# EAGLE design Christmas Tree (EAGLE 9.6.2)
CHECKED: 2021/12/20; COMPANY: https://github.com/milljohn/christmas_tree; DATE: 2018/11/05; DRAWN: 2018/11/05; DRGNO: 0; REV: 1
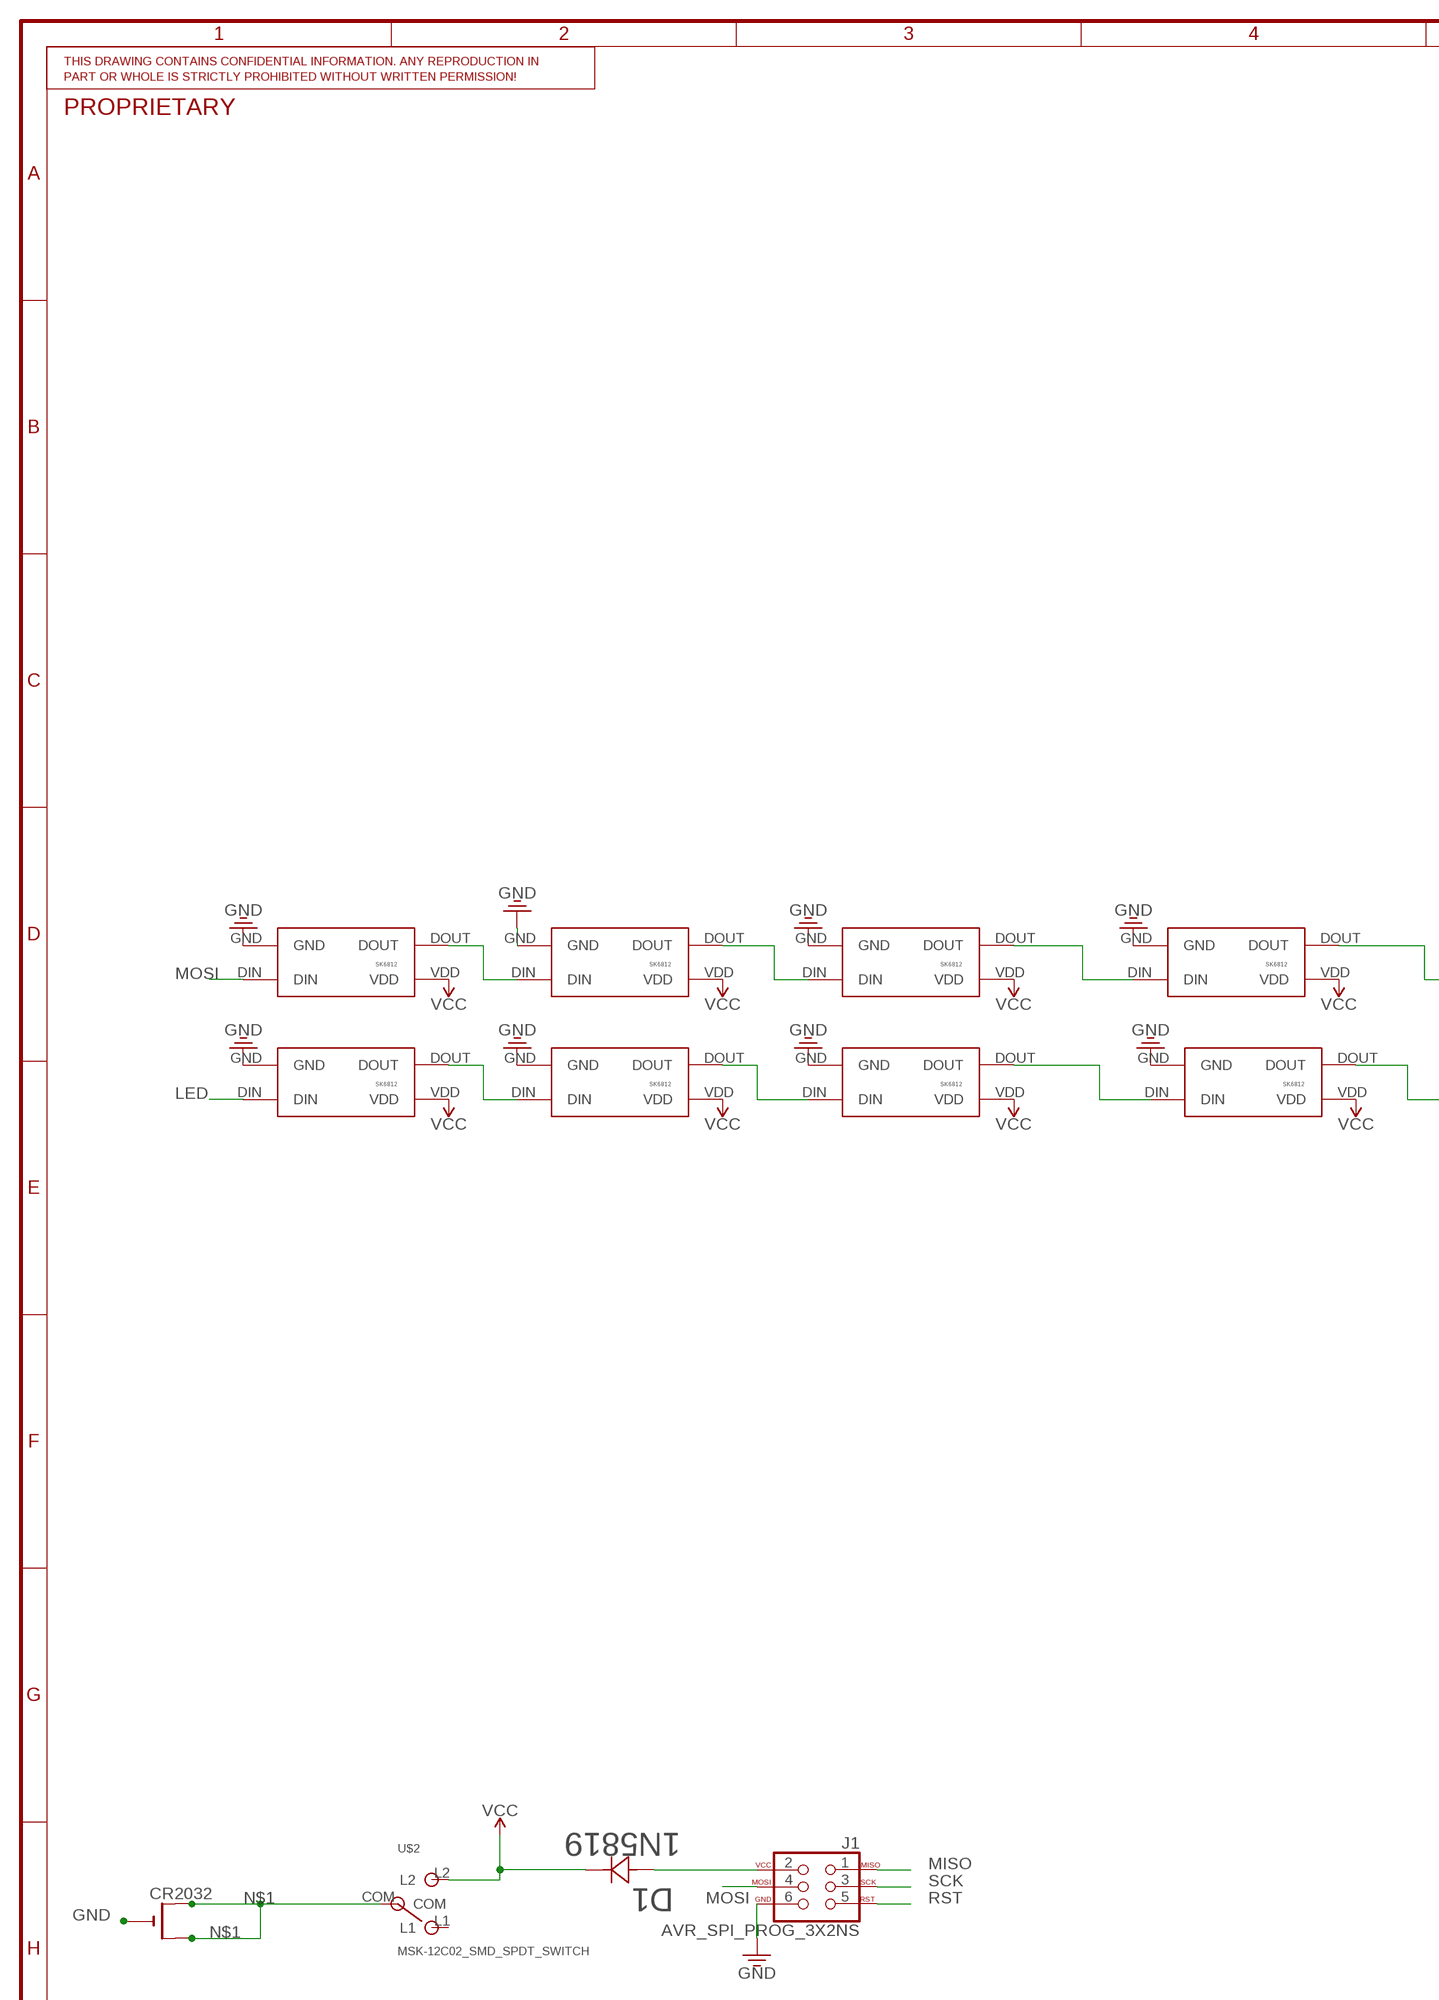
[diagram p0: schematic, sheet 1, part 1 of 2]
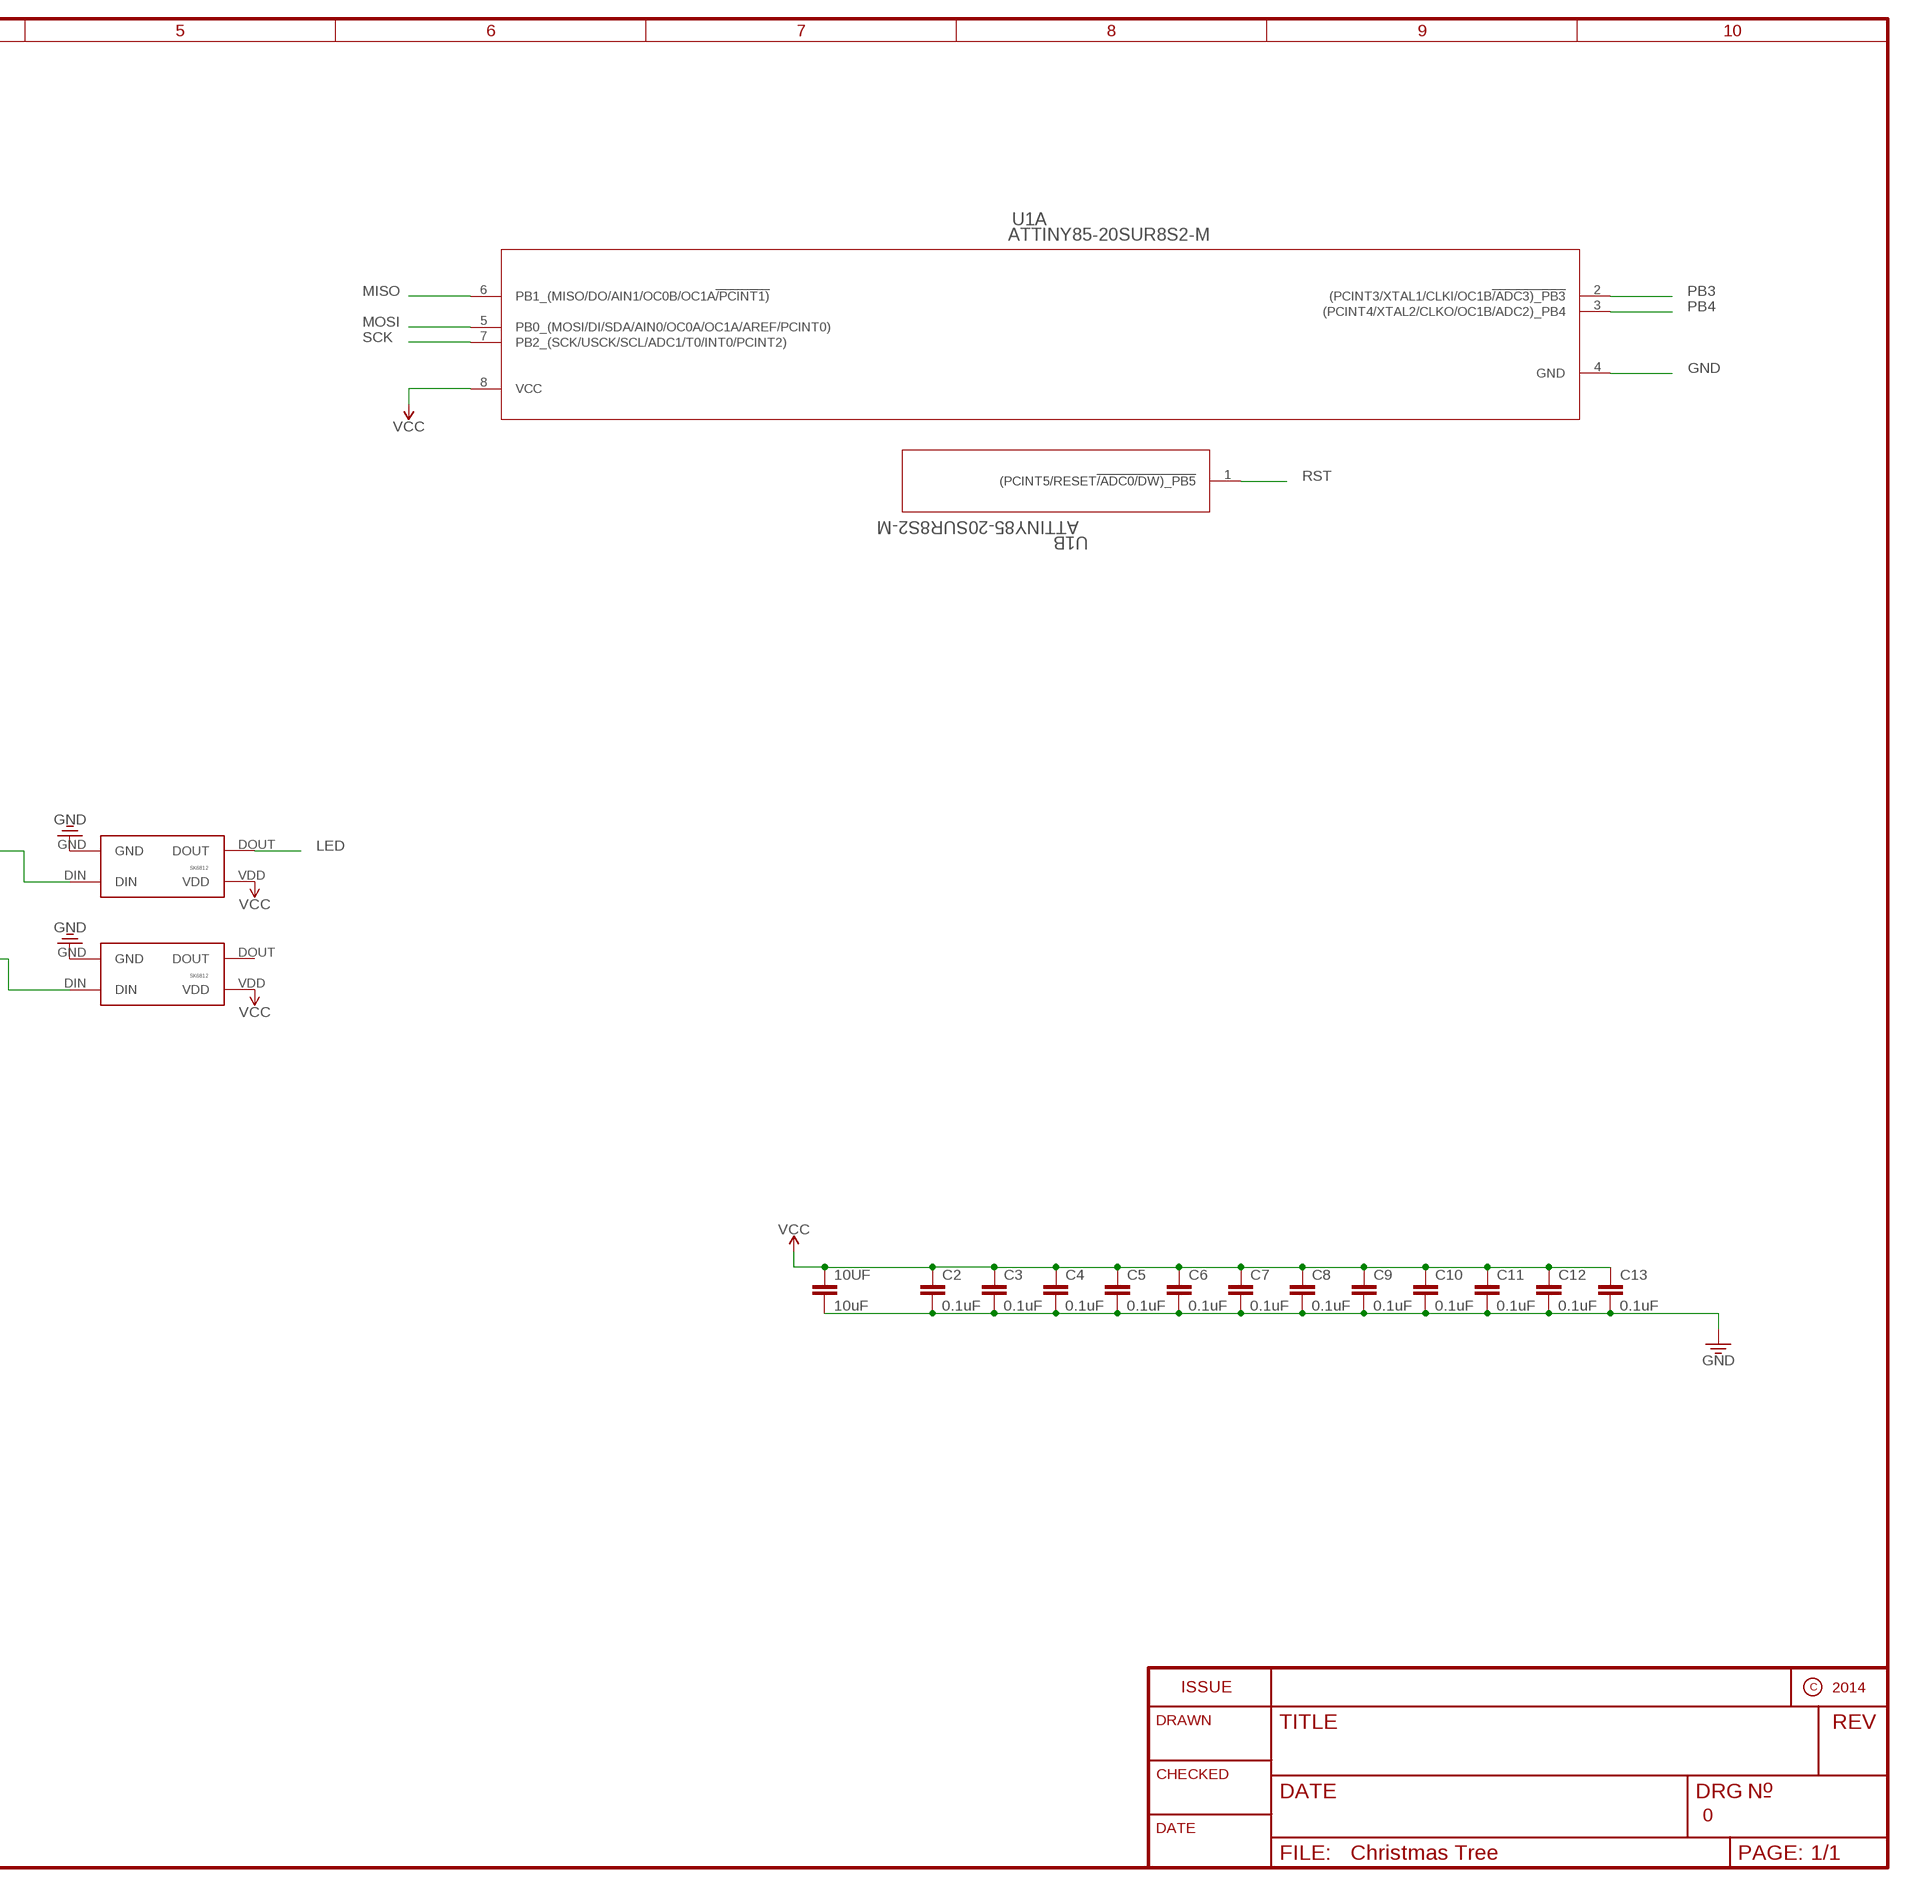
[diagram p1: schematic, sheet 1, part 2 of 2]

## Parts
10UF  10uF  CAPACITOR-N0805  [0805]
C2  0.1uF  CAPACITOR-N0805  [0805]
C3  0.1uF  CAPACITOR-N0805  [0805]
C4  0.1uF  CAPACITOR-N0805  [0805]
C5  0.1uF  CAPACITOR-N0805  [0805]
C6  0.1uF  CAPACITOR-N0805  [0805]
C7  0.1uF  CAPACITOR-N0805  [0805]
C8  0.1uF  CAPACITOR-N0805  [0805]
C9  0.1uF  CAPACITOR-N0805  [0805]
C10  0.1uF  CAPACITOR-N0805  [0805]
C11  0.1uF  CAPACITOR-N0805  [0805]
C12  0.1uF  CAPACITOR-N0805  [0805]
C13  0.1uF  CAPACITOR-N0805  [0805]
CR2032  CR2032SMT  [CR2032-SMD]
D1  1N5819  1N5819HW-7SOD123-M  [SOD123-M]
J1  AVR_SPI_PROG_3X2NS  [2X3-NS]
U1  ATTINY85-20SUR8S2-M  [8S2-M]
U$1  XMASTREE  [XMASTREE]  (not placed on a sheet)
U$2  MSK-12C02_SMD_SPDT_SWITCH  [MSK-12C02]
U$3  SK6812  [5050]
U$4  SK6812  [5050]
U$5  SK6812  [5050]
U$6  SK6812  [5050]
U$7  SK6812  [5050]
U$8  SK6812  [5050]
U$9  SK6812  [5050]
U$10  SK6812  [5050]
U$11  SK6812  [5050]
U$12  SK6812  [5050]

## Nets
GND: 10UF.2 C2.2 C3.2 C4.2 C5.2 C6.2 C7.2 C8.2 C9.2 C10.2 C11.2 C12.2 C13.2 CR2032.- J1.6 U1.4(A:GND) U$3.GND U$4.GND U$5.GND U$6.GND U$7.GND U$8.GND U$9.GND U$10.GND U$11.GND U$12.GND
LED: U$7.DOUT U$8.DIN
MISO: J1.1 U1.6(A:PB1_(MISO/DO/AIN1/OC0B/OC1A!/PCINT1))
MOSI: J1.4 U1.5(A:PB0_(MOSI/DI/SDA/AIN0/OC0A/OC1A/AREF/PCINT0)) U$3.DIN
N$1: CR2032.+$1(+) CR2032.+$2(+1) U$2.COM
N$2: U$4.DOUT U$5.DIN
N$3: U$5.DOUT U$6.DIN
N$4: U$6.DOUT U$7.DIN
N$5: U$9.DOUT U$10.DIN
N$6: U$8.DOUT U$9.DIN
N$7: U$10.DOUT U$11.DIN
N$8: U$11.DOUT U$12.DIN
N$9: U$3.DOUT U$4.DIN
N$10: D1.2 J1.2
PB3: U1.2(A:(PCINT3/XTAL1/CLKI/OC1B!/ADC3)_PB3)
PB4: U1.3(A:(PCINT4/XTAL2/CLKO/OC1B/ADC2)_PB4)
RST: J1.5 U1.1(B:(PCINT5/RESET!/ADC0/DW)_PB5)
SCK: J1.3 U1.7(A:PB2_(SCK/USCK/SCL/ADC1/T0/INT0/PCINT2))
VCC: 10UF.1 C2.1 C3.1 C4.1 C5.1 C6.1 C7.1 C8.1 C9.1 C10.1 C11.1 C12.1 C13.1 D1.1 U1.8(A:VCC) U$2.L2 U$3.VDD U$4.VDD U$5.VDD U$6.VDD U$7.VDD U$8.VDD U$9.VDD U$10.VDD U$11.VDD U$12.VDD
Unconnected: U$2.L1 U$12.DOUT

## Library data of the parts
10UF C2-C13 = BeagleBone_Blue_R3:CAPACITOR-N
CR2032 = adafruit:CR2032
D1 = smd_diodes:1N5819HW-7; MANUFACTURER_PART_NUMBER: 1N5819HW7; VENDOR: Diodes Inc
J1 = SparkFun-Connectors:AVR_SPI_PROG_3X2: AVR ISP 6 Pin This is the reduced ISP connector for AVR programming. Common on Arduino. This footprint will take up less PCB space and can be used with a 10-pin to 6-pin adapter such as SKU: BOB-08508 **Special note about "TEST_POINT" package. The stop mask is on the top side, so if you want your programming test points to be on the bottom of your board, make sure to place this package on the bottom side of the board. This also ensure that the orientation to program from the bottom side will be correct. SparkFun Products: SparkFun ISP Pogo Adapter <https://www.sparkfun.com/products/11591> - NS Tiny AVR Programmer <https://www.sparkfun.com/products/11801> -PTH
U1 = smd_leds:ATTINY85-20SUR; MANUFACTURER_PART_NUMBER: ATTINY8520SUR; VENDOR: Atmel
U$1 = smd_leds:XMASTREE
U$2 = MSK-12C02 SMD Micro Slider Switch SPDT:MSK-12C02_SMD_SPDT_SWITCH: Footprint of the VIMEX MSK-12C02 SPDT SMD Switch Created by mzst on 17-Jan-2016
U$3-U$12 = smd_leds:SK6812

## Board
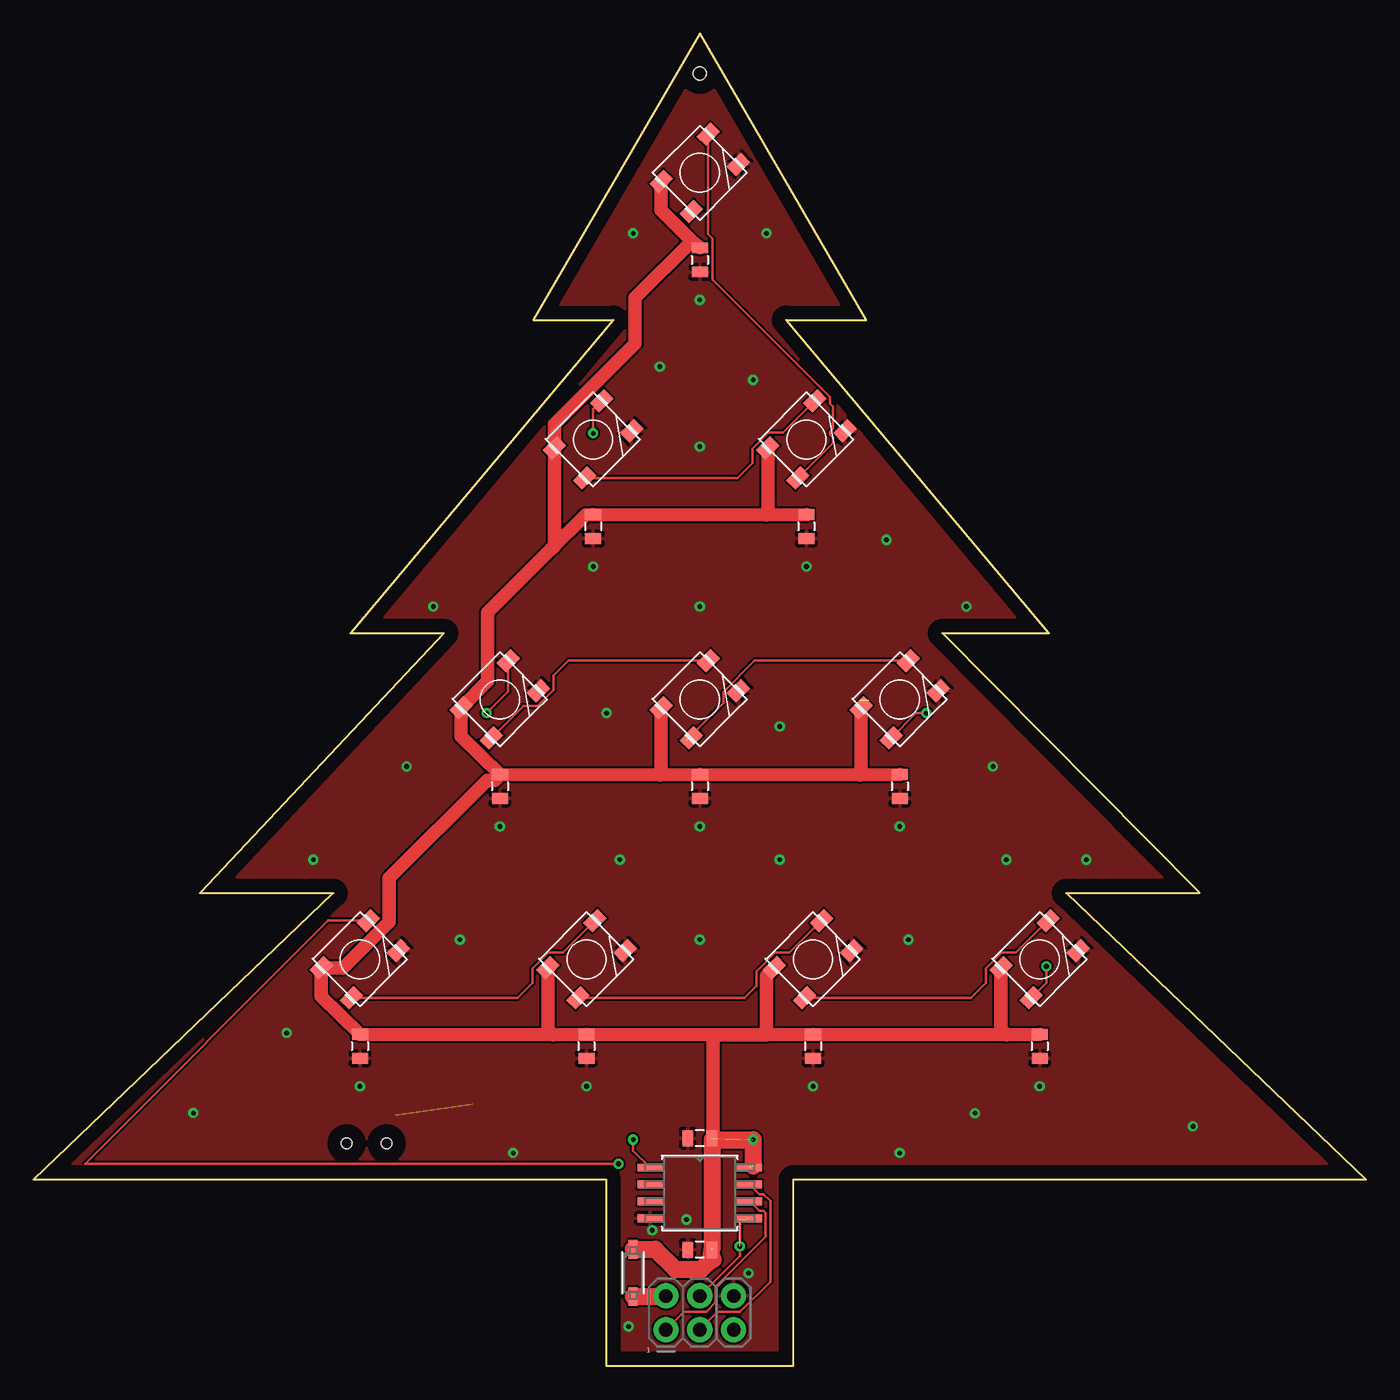
[diagram p2: board, top side]
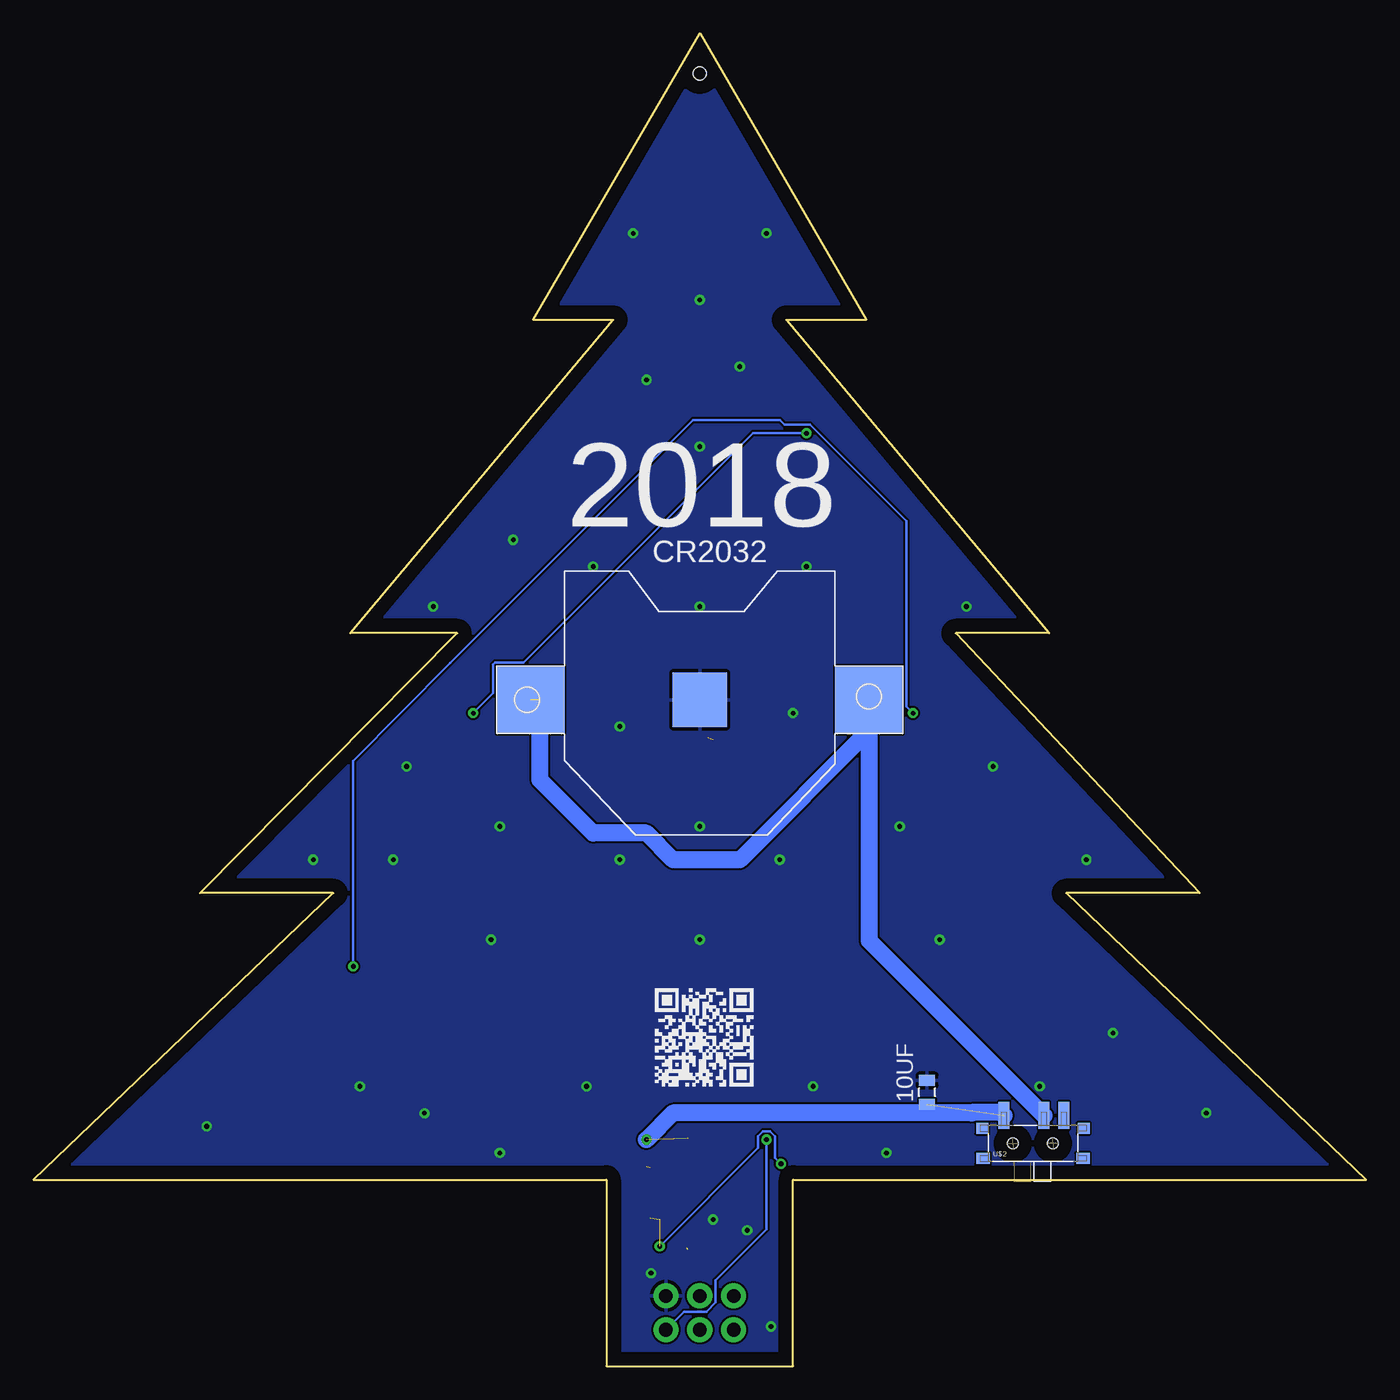
[diagram p3: board, bottom side, seen from below]

Size 100 x 100 mm. Coordinates in mm from the lower left corner, seen from the top.
Outline: 100,14 57,14 57,0 43,0 43,14 0,14 22.5,35.5 12.5,35.5 30.8,55 23.8,55 43.5,78.5 37.5,78.5 50,100 62.5,78.5 56.5,78.5 76.2,55 68.2,55 87.5,35.5 77.5,35.5 100,14
Copper layers (1*16): Top 0.035mm / dielectric 1.5mm / Bottom 0.035mm
Design rules "default": minimum track width 6mil, minimum drill 0.35mm, track to track 6mil, track to pad 6mil, pad to pad 6mil, via to via 6mil, smd to smd 6mil, copper to edge 40mil, drill to drill 6mil, minimum pad ring 10mil, minimum via ring 8mil, stop-mask expansion 4mil, vias tented up to drill 0mil, thermal gap 10mil
Holes 1 mm at 50,97

### Footprints (pad centres in the part's own frame; a part is rotated, then mirrored left to right if it is on the bottom)
0805 = smd 0.8 x 1.2: 1 -0.9,0; 2 0.9,0
CR2032-SMD = smd 5.08 x 5.08: +$1 -12.7,0; +$2 12.7,0 | smd 4.064 x 4.064: - 0,0
SOD123-M = smd 1.416 x 0.652: 1 -1.776,0; 2 1.776,0
2X3-NS = drill 1.016 pad 1.88: 1 -2.54,-1.27; 2 -2.54,1.27; 3 0,-1.27; 4 0,1.27; 5 2.54,-1.27; 6 2.54,1.27
8S2-M = smd 1.88 x 0.584: 1 -3.747,1.905; 2 -3.747,0.635; 3 -3.747,-0.635; 4 -3.747,-1.905; 5 3.747,-1.905; 6 3.747,-0.635; 7 3.747,0.635; 8 3.747,1.905
MSK-12C02 = smd 0.8 x 2: COM 0.823,2.1; L1 2.323,2.1; L2 -2.177,2.1 | smd 1 x 0.8: GND@1 -3.75,-1.125; GND@4 3.75,-1.125 | smd 0.9 x 0.8: GND@2 -3.8,1.125; GND@3 3.8,1.125 | hole 0.8: -1.5,0; 1.5,0
5050 = smd 1.5 x 1: DIN 5,4.1; DOUT 0,0.9; GND 5,0.9; VDD 0,4.1

### Placement (x,y rotation side)
10UF  32.95,20.55 90 bottom
C2  24.5,24 270 top
C3  41.5,24 270 top
C4  58.5,24 270 top
C5  75.5,24 270 top
C6  35,43.5 270 top
C7  50,43.5 270 top
C8  65,43.5 270 top
C9  42,63 270 top
C10  58,63 270 top
C11  50,83 270 top
C12  50,17.1 180 top
C13  50,8.75 180 top
CR2032  50,50 0 bottom
D1  45,7 270 top
J1  50,4 0 top
U1  50,13 0 top
U$1  46,21 0 top
U$2  25,16.71 0 bottom
U$3  24.5,27 45 top
U$4  41.5,27 45 top
U$5  58.5,27 45 top
U$6  75.5,27 45 top
U$7  35,46.5 45 top
U$8  50,46.5 45 top
U$9  65,46.5 45 top
U$10  42,66 45 top
U$11  58,66 45 top
U$12  50,86 45 top

### Tracks (layer width: path | path; a pad name or v marks a point on that pad's centre or on a via)
GND  (via drill 0.35)
  other vias: 24.5,21 50,80 42,60 58,60 65,40.5 50,40.5 35,40.5 41.5,21 58.5,21 75.5,21 55,85 45,85 12,19 36,16 65,16 87,18 79,38 73,38 56,38 44,38 21,38 43,49 56,48 70,57 50,57 30,57 50,69 44.66,2.98 53.66,6.98 70.66,18.98 50,32 65.66,32 32,32 28,45 19,25 64,62 54,74 47,75 46.44,10.19 49,11 72,45
  pour Bottom: 43,0 57,0 57,14 100,14 77.5,35.5 87.5,35.5 68.2,55 76,55 76.2,55 56.5,78.5 62.5,78.5 50,100 37.5,78.5 43.5,78.5 23.8,55 30.8,55 12.5,35.5 22.5,35.5 0,14 43,14
  pour Top: 43,0 57,0 57,14 100,14 77.5,35.5 87.5,35.5 68.2,55 76,55 76.2,55 56.5,78.5 62.5,78.5 50,100 37.5,78.5 43.5,78.5 23.8,55 30.8,55 12.5,35.5 22.5,35.5 0,14 43,14
LED
  Top 0.2: U$8.DIN 40.16,52.94 39.03,51.81 39.03,50.74 37.83,49.54 36.76,49.54 U$7.DOUT
MISO
  Top 0.2: U1.6 54.47,11.64 54.79,11.64 54.94,11.49 54.94,9.71 51.19,5.96 51.19,4.78 50.49,4.08 48.81,4.08 J1.1 47.19,3 47,3
MOSI  (via drill 0.35)  (2 unrouted)
  Top 0.2: J1.4 53,8.27 53,11 | U$3.DIN 22.14,33.44 3.89,15.19 43.49,15.19 43.5,15.19 v43.91,15.19
  Bottom 0.2: v43.91,15.19 44.37,15.65 44.37,17.26 44.74,17.63 45.26,17.63 45.63,17.26 45.63,16.37 v53,9
N$1  (1 unrouted)
  Bottom 1.27: U$2.COM 37.3,31.94 CR2032.+$2 37.3,47.7 47,38 52,38 54,40 58,40 62,44 62,50
N$2
  Top 0.2: U$4.DOUT 53.34,27.64 54.24,28.54 54.24,29.61 55.66,31.04 56.74,31.04 U$5.DIN
N$3
  Top 0.2: U$5.DOUT 70.34,27.64 71.47,28.76 71.47,29.84 72.66,31.04 73.74,31.04 U$6.DIN
N$4  (via drill 0.35)
  Top 0.2: v76,30 76,28.77 U$6.DOUT | v34,49 35.64,50.64 U$7.DIN
  Bottom 0.2: v34,49 34.51,49.51 34.51,63.4 41.74,70.63 43.63,70.63 44,71 50.5,71 68.75,52.75 76,45.42 v76,30
N$5  (via drill 0.35)
  Top 0.2: U$10.DIN 42,71.8 v42,70 | v67,49 66.23,49 U$9.DOUT
  Bottom 0.2: v42,70 46,70 63.21,52.79 65.34,52.79 65.49,52.65 65.49,50.51 v67,49
N$6  (1 unrouted)
  Top 0.2: 49,47 51.76,49.76 51.76,50.6 54.1,52.94 U$9.DIN
N$7
  Top 0.2: U$10.DOUT 52.84,66.64 53.97,67.76 53.97,68.84 55.16,70.03 56.24,70.03 U$11.DIN
N$8
  Top 0.2: U$12.DIN 50.64,84.92 50.95,84.61 50.95,81.54 59.77,72.72 59.77,72.23 60,72 60,70.34 59.76,70.1 59.76,69.89 60,69.65 60,69.27 U$11.DOUT
N$9
  Top 0.2: U$3.DOUT 36.34,27.64 37.47,28.76 37.47,29.84 38.66,31.04 39.74,31.04 U$4.DIN
N$10
  Top 1.27: J1.2 47.41,5.22 D1.2
RST  (via drill 0.35)
  Top 0.2: U1.1 45,16.16 v45,17
  Bottom 0.2: v45,17 45,10.27 48.81,6.46 48.81,4.78 49.51,4.08 51.19,4.08 J1.5
SCK
  Top 0.2: J1.3 51.35,4.08 53.03,4.08 55.29,6.33 55.29,12.41 54.79,12.91 54.47,12.91 U1.7
VCC  (via drill 0.35)  (4 unrouted)
  Top 1.016: 39,24.85 C2.1 21.6,27.75 U$3.VDD 23.24,29.9 26.68,33.34 26.68,36.61 34.03,43.96 34.61,43.96 C6.1 | 39,24.85 C3.1 51,24.85 | 51,24.85 55,24.85 | 55,24.85 C4.1 73,24.85 | 73,24.85 C5.1 | 51,24.85 51,17.05 50.95,17 | 55,24.85 55,29.3 U$5.VDD | U$6.VDD 72.6,25.25 73,24.85 | U$4.VDD 38.6,25.25 39,24.85 | C6.1 47,44.35 | 47,44.35 C7.1 62,44.35 | 62,44.35 C8.1 | U$8.VDD 47.1,44.45 47,44.35 | U$9.VDD 62.1,44.45 62,44.35 | C6.1 32.1,47.25 U$7.VDD 34.09,51.39 34.09,56.52 38.78,61.22 | 55,63.85 C9.1 41.42,63.85 38.78,61.22 | 55,63.85 C10.1 | 38.78,61.22 39.1,61.53 U$10.VDD 39.1,70.68 45.15,76.73 45.15,80.15 49.42,84.42 | U$11.VDD 55.1,63.95 55,63.85 | U$12.VDD 47.1,86.75 49.42,84.42 | 49.42,84.42 C11.1
  Top 1.27: 54,15 v54,17 50.95,17 50.95,8.85 | D1.1 46.66,8.78 48.17,7.26 50.13,7.26 50.86,8 51,8 50.85,8.15 C13.1
  Bottom 1.27: U$2.L2 27.39,19.03 29.58,19.03 29.6,19 52,19 v54,17

### Text on the board
tNames: 1
bNames: 2018